# EAGLE design level-shifter-v1.0 (EAGLE 9.6.2)
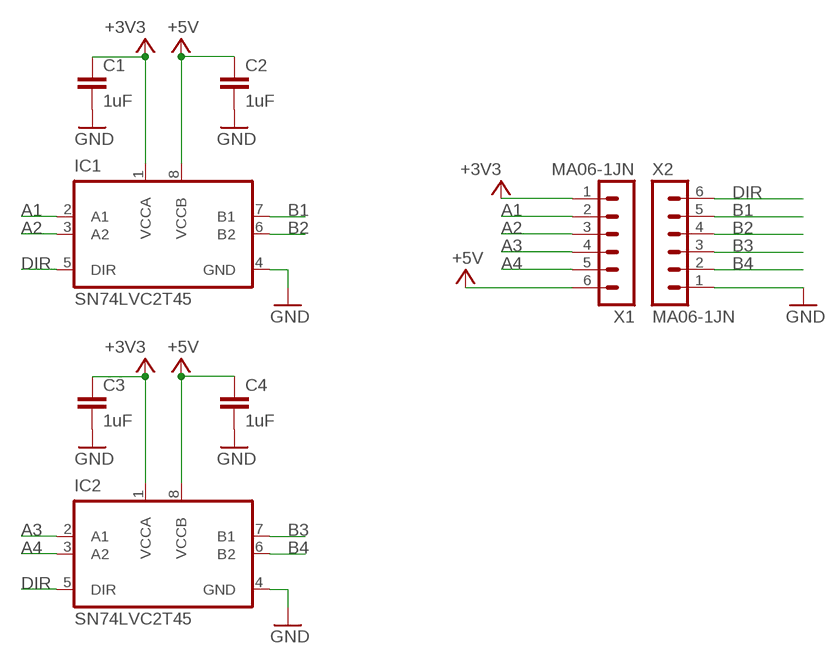
[diagram p0: schematic, sheet 1]

## Parts
C1  1uF  C-EU-J0402  [C0402-J]
C2  1uF  C-EU-J0402  [C0402-J]
C3  1uF  C-EU-J0402  [C0402-J]
C4  1uF  C-EU-J0402  [C0402-J]
IC1  SN74LVC2T45  [VSSOP8J]
IC2  SN74LVC2T45  [VSSOP8J]
X1  MA06-1JN  [MA06N-1J]
X2  MA06-1JN  [MA06N-1J]

## Nets
+3V3: C1.1 C3.1 IC1.1(VCCA) IC2.1(VCCA) X1.1
+5V: C2.1 C4.1 IC1.8(VCCB) IC2.8(VCCB) X1.6
A1: IC1.2(A1) X1.2
A2: IC1.3(A2) X1.3
A3: IC2.2(A1) X1.4
A4: IC2.3(A2) X1.5
B1: IC1.7(B1) X2.5
B2: IC1.6(B2) X2.4
B3: IC2.7(B1) X2.3
B4: IC2.6(B2) X2.2
DIR: IC1.5(DIR) IC2.5(DIR) X2.6
GND: C1.2 C2.2 C3.2 C4.2 IC1.4(GND) IC2.4(GND) X2.1

## Library data of the parts
C1-C4 = joakim:C-EU-J: CAPACITOR, European symbol
IC1 IC2 = joakim:SN74LVC2T45: SN74LVC2T45 Dual-bit dual-supply bus transceiver with configurable voltage translation and 3-state outputs Single-direction 3.3V to 5V / 5V to 3.3V voltage translator
X1 X2 = joakim:MA06-1J

## Board
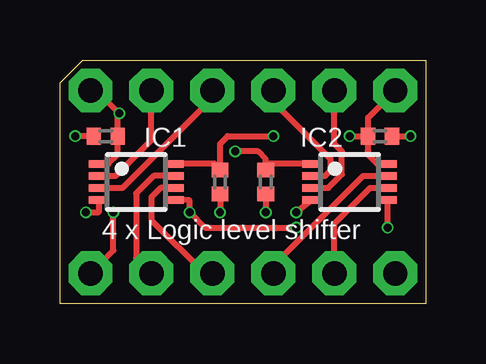
[diagram p1: board, top side]
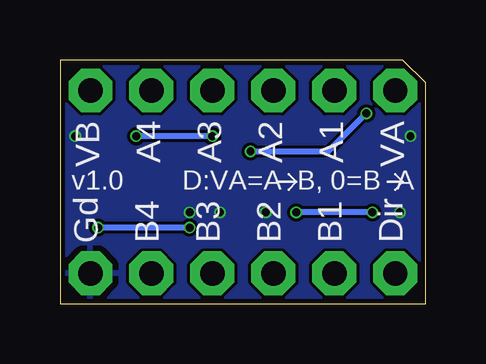
[diagram p2: board, bottom side, seen from below]

Size 15.24 x 10.16 mm. Coordinates in mm from the lower left corner, seen from the top.
Outline: 0,0 0,9.21 0.95,10.16 15.24,10.16 15.24,0 0,0
Copper layers (1*16): Top 0.035mm / dielectric 1.6mm / Bottom 0.035mm
Design rules "jlcpcb-2layers": minimum track width 5mil, minimum drill 0.3mm, track to track 5mil, track to pad 5mil, pad to pad 5mil, via to via 5mil, smd to smd 5mil, copper to edge 0.2mm, drill to drill 6mil, minimum pad ring 10mil, minimum via ring 3mil, stop-mask expansion 4mil, vias tented up to drill 0mil, thermal gap 10mil

### Footprints (pad centres in the part's own frame; a part is rotated, then mirrored left to right if it is on the bottom)
C0402-J = smd 0.6 x 0.7: 1 -0.5,0; 2 0.5,0
VSSOP8J = smd 0.3 x 0.85: 1 -0.75,-1.55; 2 -0.25,-1.55; 3 0.25,-1.55; 4 0.75,-1.55; 5 0.75,1.55; 6 0.25,1.55; 7 -0.25,1.55; 8 -0.75,1.55
MA06N-1J = drill 1.016 octagon: 1 -6.35,0; 2 -3.81,0; 3 -1.27,0; 4 1.27,0; 5 3.81,0; 6 6.35,0

### Placement (x,y rotation side)
C1  1.91,6.99 180 top
C2  6.67,5.08 270 top
C3  8.57,5.08 270 top
C4  13.34,6.99 0 top
IC1  3.17,5.08 270 top
IC2  12.06,5.08 270 top
X1  7.62,8.89 0 top
X2  7.62,1.27 180 top

### Tracks (layer width: path | path; a pad name or v marks a point on that pad's centre or on a via)
+3V3  (via drill 0.33)
  Top 0.254: IC1.1 2.02,5.83 2.4,6.21 C1.1 | C1.1 2.48,7.06 | v7.3,6.35 8.26,6.35 8.57,6.03 8.57,5.71 | X1.1 1.52,8.89 v2.48,7.94 2.4,7.87 C1.1 | C3.1 8.57,5.71 | IC2.1 8.69,5.83 8.57,5.71
  Bottom 0.254: v2.48,7.94 4.06,6.35 v7.3,6.35
+5V  (via drill 0.33)
  Top 0.254: IC1.8 6.46,5.83 6.46,5.78 C2.1 6.67,6.67 6.99,6.99 v8.89,6.99 | v12.06,6.99 C4.1 | IC2.8 13.22,5.83 12.84,6.21 C4.1 | C4.1 12.84,7.75 X1.6
  Bottom 0.254: v8.89,6.99 v12.06,6.99
A1
  Top 0.254: IC1.2 2.31,5.33 3.81,6.83 X1.2
A2
  Top 0.254: IC1.3 2.61,4.83 6.35,8.57 X1.3
A3
  Top 0.254: IC2.2 11.04,5.33 11.27,5.56 11.27,6.03 8.89,8.41 X1.4
A4
  Top 0.254: IC2.3 11.18,4.83 11.75,5.4 11.75,6.35 11.43,6.67 X1.5
B1
  Top 0.254: IC1.7 3.9,5.33 3.17,4.6 3.17,1.91 X2.5
B2
  Top 0.254: IC1.6 4.2,4.83 3.81,4.45 3.81,3.49 6.03,1.27 X2.4
B3
  Top 0.254: X2.3 8.89,1.59 12.63,5.33 IC2.7
B4
  Top 0.254: X2.2 11.43,3.33 12.93,4.83 IC2.6
DIR  (via drill 0.33)
  Top 0.254: X2.6 2.22,2.22 v2.22,3.81 | IC1.5 5.4,4.31 v5.4,3.81 6.03,3.17 v9.84,3.17 | v13.65,3.17 13.65,4.24 13.63,4.26 13.65,4.29 IC2.5
  Bottom 0.254: v2.22,3.81 v5.4,3.81 | v9.84,3.17 v13.65,3.17
GND  (via drill 0.33)
  Top 0.254: C1.2 v0.64,6.99 | IC2.4 9.87,3.83 v9.84,3.81 | C2.2 v6.67,3.81 | C3.2 v8.57,3.81 | C4.2 v14.61,6.99 | IC1.4 1.62,3.85 1.59,3.81 v1.08,3.81
  pour Bottom: -0.32,10.48 15.56,10.48 15.56,-0.32 -0.32,-0.32

### Text on the board
tNames: 4 x Logic level shifter
bNames: VA | A1 | A2 | A3 | A4 | VB | D:VA=A B, 0=B A | v1.0 | Dir | B1 | B2 | B3 | B4 | Gd